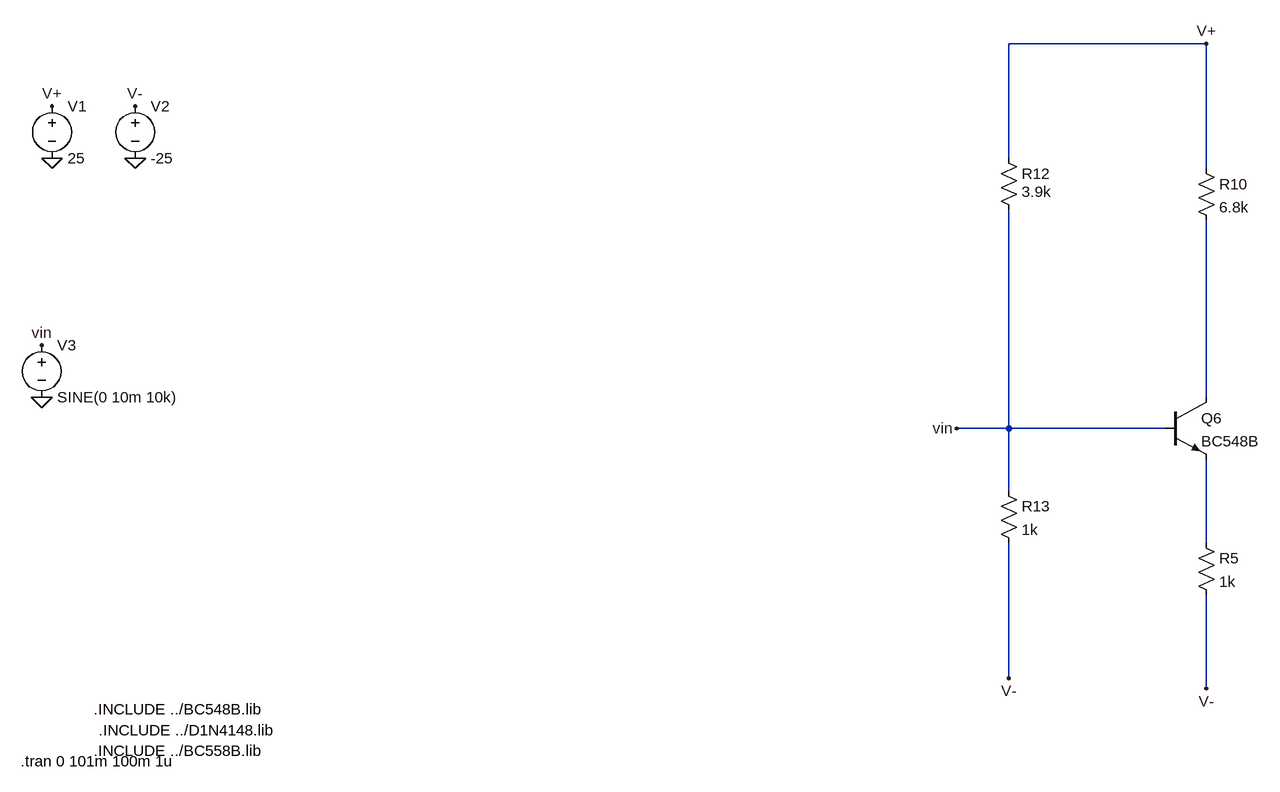
[diagram p0: schematic emisor_comun.asc]
emisor_comun.asc, the LTspice schematic file:
Version 4
SHEET 1 4564 1376
WIRE 3392 -1312 3088 -1312
WIRE 3088 -1136 3088 -1312
WIRE 3392 -1120 3392 -1312
WIRE 3392 -768 3392 -1040
WIRE 3088 -720 3088 -1056
WIRE 3088 -720 3008 -720
WIRE 3328 -720 3088 -720
WIRE 3088 -624 3088 -720
WIRE 3392 -544 3392 -672
WIRE 3088 -336 3088 -544
WIRE 3392 -320 3392 -464
FLAG 1616 -1216 V+
FLAG 1744 -1216 V-
FLAG 1600 -848 vin
FLAG 1744 -1136 0
FLAG 1616 -1136 0
FLAG 1600 -768 0
FLAG 3392 -1312 V+
FLAG 3392 -320 V-
FLAG 3088 -336 V-
FLAG 3008 -720 vin
SYMBOL voltage 1616 -1232 R0
WINDOW 123 0 0 Left 2
WINDOW 39 0 0 Left 2
SYMATTR InstName V1
SYMATTR Value 25
SYMBOL voltage 1744 -1232 R0
WINDOW 123 0 0 Left 2
WINDOW 39 0 0 Left 2
SYMATTR InstName V2
SYMATTR Value -25
SYMBOL voltage 1600 -864 R0
WINDOW 123 0 0 Left 2
WINDOW 39 0 0 Left 2
SYMATTR InstName V3
SYMATTR Value SINE(0 10m 10k)
SYMBOL npn 3328 -768 R0
SYMATTR InstName Q6
SYMATTR Value BC548B
SYMBOL res 3376 -560 R0
SYMATTR InstName R5
SYMATTR Value 1k
SYMBOL res 3376 -1136 R0
SYMATTR InstName R10
SYMATTR Value 6.8k
SYMBOL res 3072 -1152 R0
WINDOW 3 36 68 Left 2
SYMATTR Value 3.9k
SYMATTR InstName R12
SYMBOL res 3072 -640 R0
SYMATTR InstName R13
SYMATTR Value 1k
TEXT 1680 -288 Left 2 !.INCLUDE ../BC548B.lib
TEXT 1688 -256 Left 2 !.INCLUDE ../D1N4148.lib
TEXT 1680 -224 Left 2 !.INCLUDE ../BC558B.lib
TEXT 1568 -208 Left 2 !.tran 0 101m 100m 1u

The netlist it stands for:
* emisor_comun.asc
V1 V+ 0 25
V2 V- 0 -25
V3 vin 0 SINE(0 10m 10k)
Q6 N001 vin N002 0 BC548B
R5 N002 V- 1k
R10 V+ N001 6.8k
R12 V+ vin 3.9k
R13 vin V- 1k
.model NPN NPN
.model PNP PNP
.lib standard.bjt
.INCLUDE ../BC548B.lib
.INCLUDE ../D1N4148.lib
.INCLUDE ../BC558B.lib
.tran 0 101m 100m 1u
.backanno
.end